# Altium schematic sheet Main.SchDoc
size A3
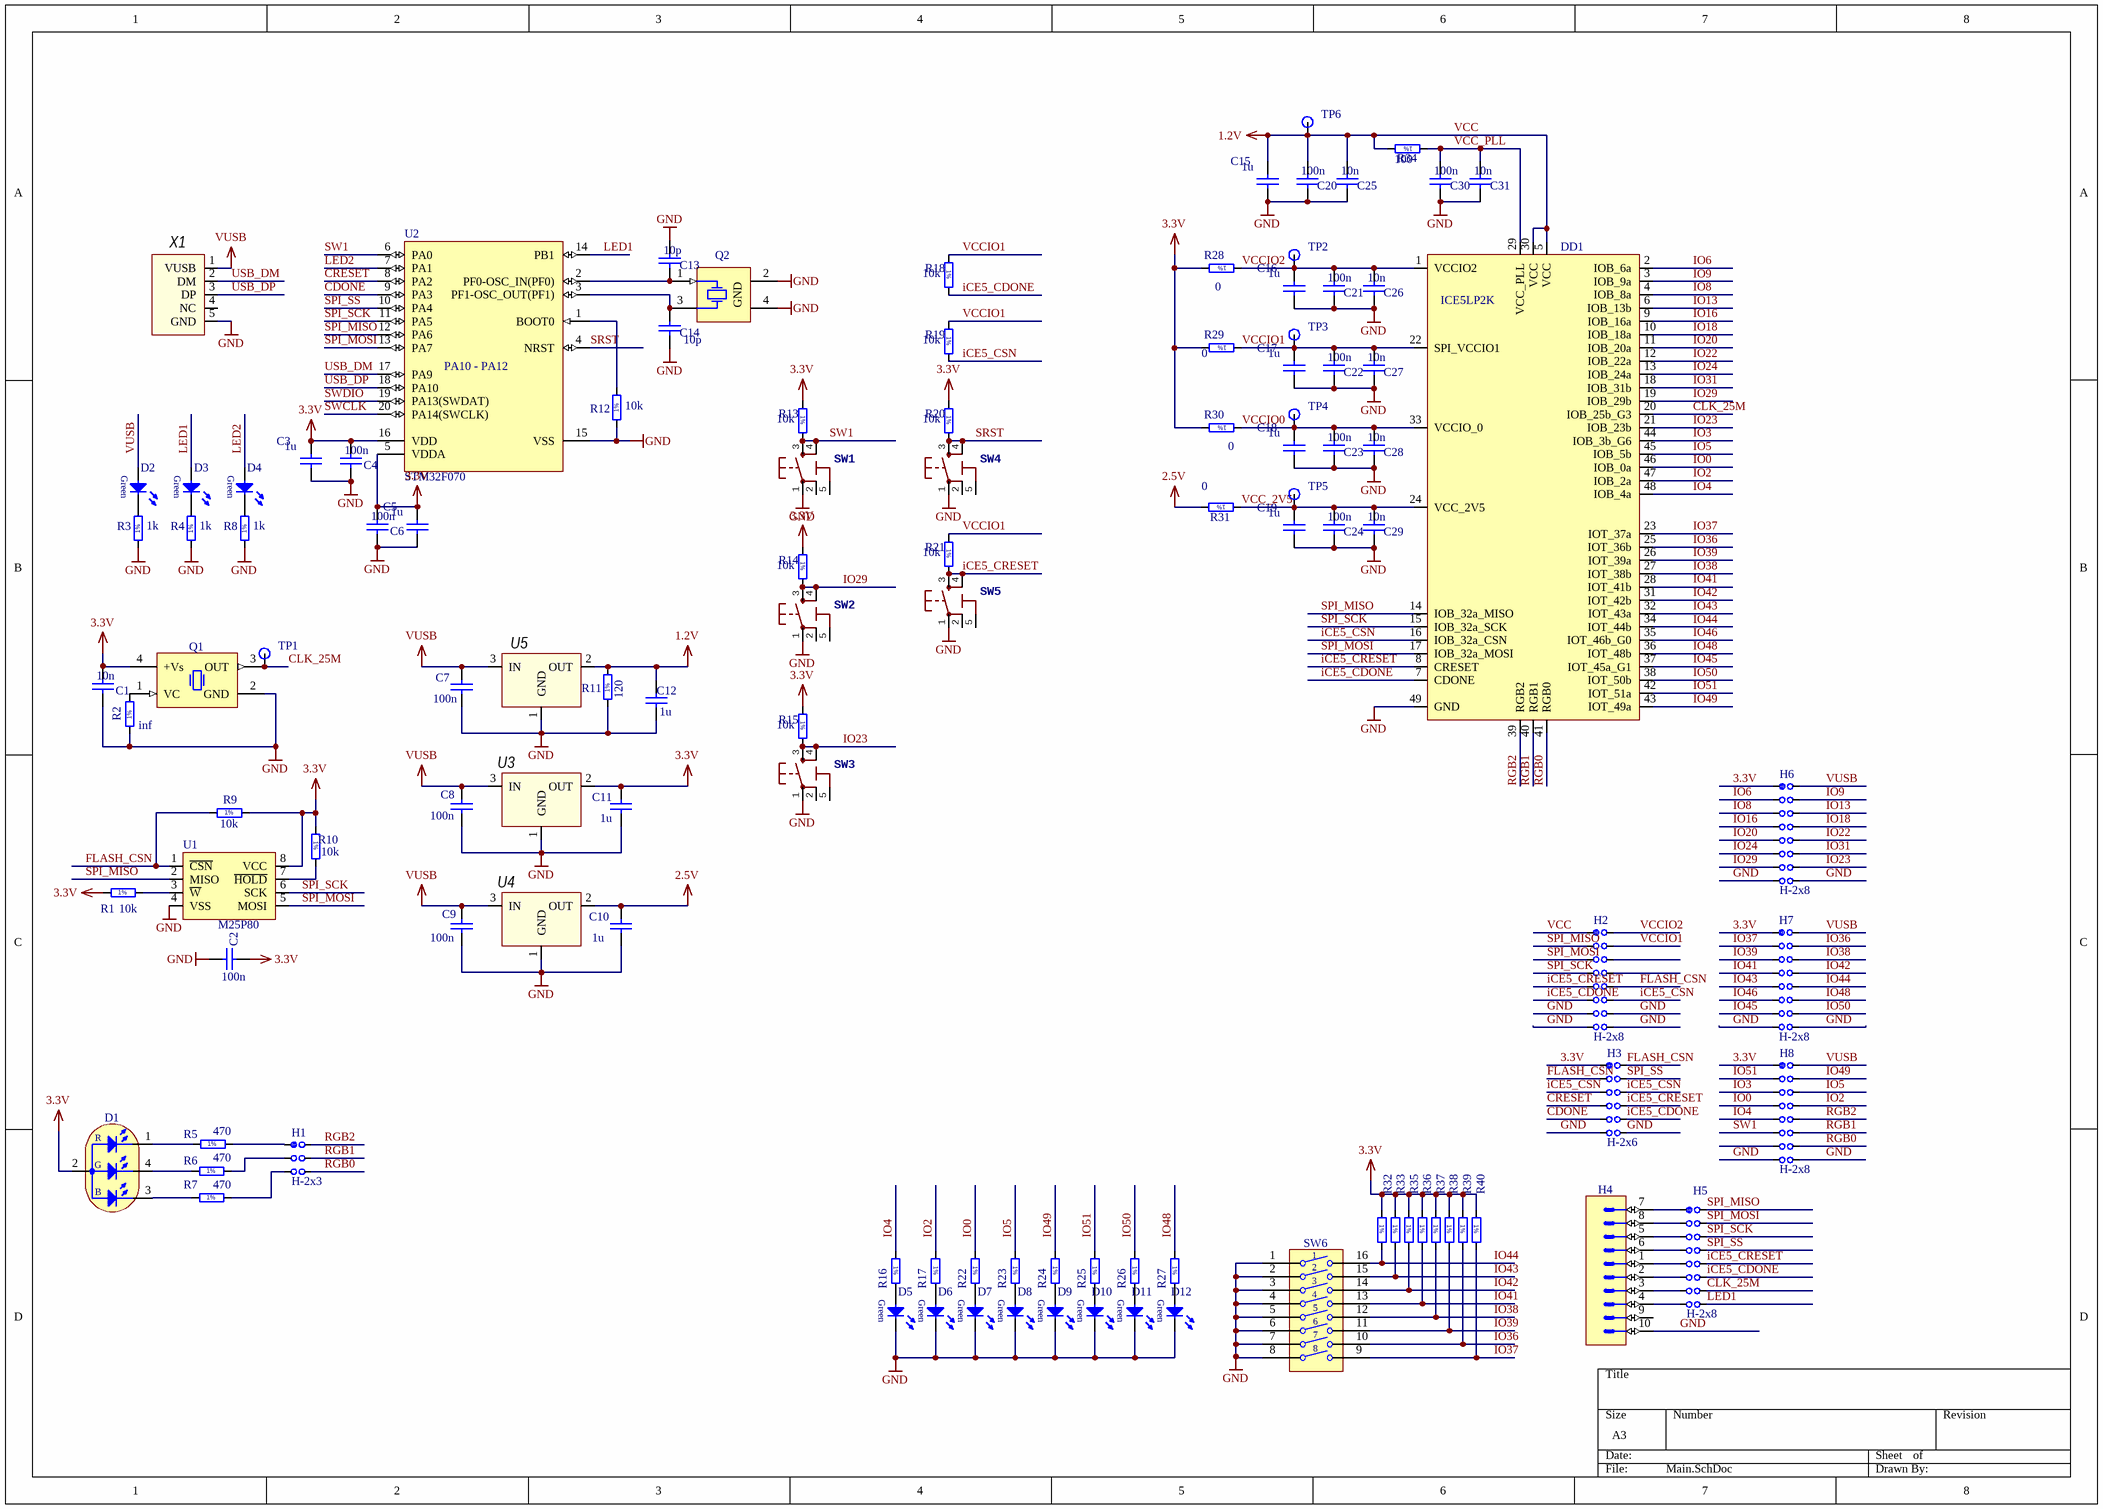
[diagram p0: Main.SchDoc]

## Parts
C1  10n  [CAPC1005X55N]
C2  100n  [CAPC1005X55N]
C3  1u  [CAPC1005X55N]
C4  100n  [CAPC1005X55N]
C5  1u  [CAPC1005X55N]
C6  100n  [CAPC1005X55N]
C7  100n  [CAPC1608X85N]
C8  100n  [CAPC1608X85N]
C9  100n  [CAPC1608X85N]
C10  1u  [CAPC1608X85N]
C11  1u  [CAPC1608X85N]
C12  1u  [CAPC1608X85N]
C13  10p  [CAPC1005X55N]
C14  10p  [CAPC1005X55N]
C15  1u  [CAPC1005X55N]
C16  1u  [CAPC1005X55N]
C17  1u  [CAPC1005X55N]
C18  1u  [CAPC1005X55N]
C19  1u  [CAPC1005X55N]
C20  100n  [CAPC1005X55N]
C21  100n  [CAPC1005X55N]
C22  100n  [CAPC1005X55N]
C23  100n  [CAPC1005X55N]
C24  100n  [CAPC1005X55N]
C25  10n  [CAPC1005X55N]
C26  10n  [CAPC1005X55N]
C27  10n  [CAPC1005X55N]
C28  10n  [CAPC1005X55N]
C29  10n  [CAPC1005X55N]
C30  100n  [CAPC1005X55N]
C31  10n  [CAPC1005X55N]
D1  Red/Green/Blue  [LED_CREE_CLV1A-FKB]  (value not drawn)
D2  Green  [LED_OSRAM_LGL29K]  (value not drawn)
D3  Green  [LED_OSRAM_LGL29K]  (value not drawn)
D4  Green  [LED_OSRAM_LGL29K]  (value not drawn)
D5  Green  [LED_OSRAM_LGL29K]  (value not drawn)
D6  Green  [LED_OSRAM_LGL29K]  (value not drawn)
D7  Green  [LED_OSRAM_LGL29K]  (value not drawn)
D8  Green  [LED_OSRAM_LGL29K]  (value not drawn)
D9  Green  [LED_OSRAM_LGL29K]  (value not drawn)
D10  Green  [LED_OSRAM_LGL29K]  (value not drawn)
D11  Green  [LED_OSRAM_LGL29K]  (value not drawn)
D12  Green  [LED_OSRAM_LGL29K]  (value not drawn)
DD1  ICE5LP2K  [QFN50P700X700X100_HS-49L]
H1  H-2x3  [J2x3]
H2  H-2x8  [J2x8]
H3  H-2x6  [J2x6]
H4  Header 10  [3M_N2510-6002RB]  (value not drawn)
H5  H-2x8  [J2x8]
H6  H-2x8  [J2x8]
H7  H-2x8  [J2x8]
H8  H-2x8  [J2x8]
Q1  25MHz  [OSCCC320X500X160-4N]  (value not drawn)
Q2  114.285MHZ  [XTAL_CONNOR_CS]  (value not drawn)
R1  10k  [RESC1608X55N]
R2  inf  [RESC1608X55N]
R3  1k  [RESC1608X55N]
R4  1k  [RESC1608X55N]
R5  470  [RESC2012X60N]
R6  470  [RESC2012X60N]
R7  470  [RESC2012X60N]
R8  1k  [RESC1608X55N]
R9  10k  [RESC1608X55N]
R10  10k  [RESC1608X55N]
R11  120  [RESC1608X55N]
R12  10k  [RESC1608X55N]
R13  10k  [RESC1608X55N]
R14  10k  [RESC1608X55N]
R15  10k  [RESC1608X55N]
R16  1k  [RESC1608X55N]  (value not drawn)
R17  1k  [RESC1608X55N]  (value not drawn)
R18  10k  [RESC1608X55N]
R19  10k  [RESC1608X55N]
R20  10k  [RESC1608X55N]
R21  10k  [RESC1608X55N]
R22  1k  [RESC1608X55N]  (value not drawn)
R23  1k  [RESC1608X55N]  (value not drawn)
R24  1k  [RESC1608X55N]  (value not drawn)
R25  1k  [RESC1608X55N]  (value not drawn)
R26  1k  [RESC1608X55N]  (value not drawn)
R27  1k  [RESC1608X55N]  (value not drawn)
R28  0  [RESC1608X55N]
R29  0  [RESC1608X55N]
R30  0  [RESC1608X55N]
R31  0  [RESC1608X55N]
R32  10k  [RESC1608X55N]  (value not drawn)
R33  10k  [RESC1608X55N]  (value not drawn)
R34  100  [RESC1608X55N]
R35  10k  [RESC1608X55N]  (value not drawn)
R36  10k  [RESC1608X55N]  (value not drawn)
R37  10k  [RESC1608X55N]  (value not drawn)
R38  10k  [RESC1608X55N]  (value not drawn)
R39  10k  [RESC1608X55N]  (value not drawn)
R40  10k  [RESC1608X55N]  (value not drawn)
SW1  TS42 Dongnan Electronics Tact switch VDC 12V - 50mA  [TS42]  (value not drawn)
SW2  TS42 Dongnan Electronics Tact switch VDC 12V - 50mA  [TS42]  (value not drawn)
SW3  TS42 Dongnan Electronics Tact switch VDC 12V - 50mA  [TS42]  (value not drawn)
SW4  TS42 Dongnan Electronics Tact switch VDC 12V - 50mA  [TS42]  (value not drawn)
SW5  TS42 Dongnan Electronics Tact switch VDC 12V - 50mA  [TS42]  (value not drawn)
SW6  Switch  [SW_TYCO_1825057-7]  (value not drawn)
TP1  TP  [TP no hole]  (value not drawn)
TP2  TP  [TP no hole]  (value not drawn)
TP3  TP  [TP no hole]  (value not drawn)
TP4  TP  [TP no hole]  (value not drawn)
TP5  TP  [TP no hole]  (value not drawn)
TP6  TP  [TP no hole]  (value not drawn)
U1  M25P80  [SOIC127P600X175-8L]
U2  STM32F070  [SOP127P600-8N]
U3  LD1117V33  [SOT230P700X180-4L]  (value not drawn)
U4  LD1117V33  [SOT230P700X180-4L]  (value not drawn)
U5  LD1117V33  [SOT230P700X180-4L]  (value not drawn)
X1  uUSB  [USB-MICROB]  (value not drawn)

## Nets
2.5V: C10.2 R31.2 U4.2(OUT)
3.3V: C1.2 C2.1 C3.2 C4.2 C5.2 C6.2 C11.2 D1.2(AC) H3.1 H6.1 H7.1 H8.1 Q1.4(+Vs) R1.1 R9.2 R10.1 R13.1 R14.1 R15.1 R20.1 R28.2 R29.2 R30.2 R32.1 R33.1 R35.1 R36.1 R37.1 R38.1 R39.1 R40.1 U1.8(VCC) U2.5(VDDA) U2.16(VDD) U3.2(OUT)
GND: C1.1 C2.2 C3.1 C4.1 C5.1 C6.1 C7.1 C8.1 C9.1 C10.1 C11.1 C12.1 C13.2 C14.1 C15.1 C16.1 C17.1 C18.1 C19.1 C20.1 C21.1 C22.1 C23.1 C24.1 C25.1 C26.1 C27.1 C28.1 C29.1 C30.1 C31.1 D5.1(C) D6.1(C) D7.1(C) D8.1(C) D9.1(C) D10.1(C) D11.1(C) D12.1(C) DD1.49(GND) H2.1 H2.2 H2.3 H2.4 H3.7 H3.8 H4.10 H6.15 H6.16 H7.15 H7.16 H8.15 H8.16 Q1.2(GND) Q2.2(GND) Q2.4(GND) R2.1 R3.1 R4.1 R8.1 R11.1 R12.1 SW1.1 SW2.1 SW3.1 SW4.1 SW5.1 SW6.1 SW6.2 SW6.3 SW6.4 SW6.5 SW6.6 SW6.7 SW6.8 U1.4(VSS) U2.15(VSS) U3.1(GND) U4.1(GND) U5.1(GND) X1.5(GND)
VCC: C12.2 C15.2 C20.2 C25.2 DD1.5(VCC) DD1.30(VCC) H2.9 R11.2 R34.2 TP6.1 U5.2(OUT)  [also labelled 1.2V]
VUSB: C7.2 C8.2 C9.2 D2.2(A) H6.2 H7.2 H8.2 U3.3(IN) U4.3(IN) U5.3(IN) X1.1(VUSB)
CDONE: H3.11 U2.9(PA3)
CLK_25M: DD1.20(IOB_25b_G3) H5.14 Q1.3(OUT) TP1.1
CRESET: H3.9 U2.8(PA2)
FLASH_CSN: H2.16 H3.2 H3.3 R9.1 U1.1(~{CSN})
iCE5_CDONE: DD1.7(CDONE) H2.5 H3.12 H5.12 R18.2
iCE5_CRESET: DD1.8(CRESET) H2.7 H3.10 H5.10 R21.2 SW5.3 SW5.4
iCE5_CSN: DD1.16(IOB_32a_CSN) H2.14 H3.5 H3.6 R19.2
IO0: DD1.46(IOB_0a) H8.9 R22.1
IO2: DD1.47(IOB_2a) H8.12 R17.1
IO3: DD1.44(IOB_3b_G6) H8.7
IO4: DD1.48(IOB_4a) H8.11 R16.1
IO5: DD1.45(IOB_5b) H8.10 R23.1
IO6: DD1.2(IOB_6a) H6.3
IO8: DD1.4(IOB_8a) H6.5
IO9: DD1.3(IOB_9a) H6.4
IO13: DD1.6(IOB_13b) H6.6
IO16: DD1.9(IOB_16a) H6.7
IO18: DD1.10(IOB_18a) H6.8
IO20: DD1.11(IOB_20a) H6.9
IO22: DD1.12(IOB_22a) H6.10
IO23: DD1.21(IOB_23b) H6.14 R15.2 SW3.3 SW3.4
IO24: DD1.13(IOB_24a) H6.11
IO29: DD1.19(IOB_29b) H6.13 R14.2 SW2.3 SW2.4
IO31: DD1.18(IOB_31b) H6.12
IO36: DD1.25(IOT_36b) H7.4 R39.2 SW6.10
IO37: DD1.23(IOT_37a) H7.3 R40.2 SW6.9
IO38: DD1.27(IOT_38b) H7.6 R37.2 SW6.12
IO39: DD1.26(IOT_39a) H7.5 R38.2 SW6.11
IO41: DD1.28(IOT_41b) H7.7 R36.2 SW6.13
IO42: DD1.31(IOT_42b) H7.8 R35.2 SW6.14
IO43: DD1.32(IOT_43a) H7.9 R33.2 SW6.15
IO44: DD1.34(IOT_44b) H7.10 R32.2 SW6.16
IO45: DD1.37(IOT_45a_G1) H7.13
IO46: DD1.35(IOT_46b_G0) H7.11
IO48: DD1.36(IOT_48b) H7.12 R27.1
IO49: DD1.43(IOT_49a) H8.8 R24.1
IO50: DD1.38(IOT_50b) H7.14 R26.1
IO51: DD1.42(IOT_51a) H8.5 R25.1
LED1: D3.2(A) H5.16 U2.14(PB1)
LED2: D4.2(A) U2.7(PA1)
RGB0: DD1.41(RGB0) H1.6 H8.6
RGB1: DD1.40(RGB1) H1.4 H8.3
RGB2: DD1.39(RGB2) H1.2 H8.4
SPI_MISO: DD1.14(IOB_32a_MISO) H2.15 H5.2 U1.2(MISO) U2.12(PA6)
SPI_MOSI: DD1.17(IOB_32a_MOSI) H2.13 H5.4 U1.5(MOSI) U2.13(PA7)
SPI_SCK: DD1.15(IOB_32a_SCK) H2.11 H5.6 U1.6(SCK) U2.11(PA5)
SPI_SS: H3.4 H5.8 U2.10(PA4)
SRST: R20.2 SW4.3 SW4.4 U2.4(NRST)
SW1: H8.14 R13.2 SW1.3 SW1.4 U2.6(PA0)
SWCLK: U2.20(PA14(SWCLK))
SWDIO: U2.19(PA13(SWDAT))
USB_DM: U2.17(PA9) X1.2(DM)
USB_DP: U2.18(PA10) X1.3(DP)
VCC_2V5: C19.2 C24.2 C29.2 DD1.24(VCC_2V5) R31.1 TP5.1
VCC_PLL: C30.2 C31.2 DD1.29(VCC_PLL) R34.1
VCCIO0: C18.2 C23.2 C28.2 DD1.33(VCCIO_0) R30.1 TP4.1
VCCIO1: C17.2 C22.2 C27.2 DD1.22(SPI_VCCIO1) H2.10 R18.1 R19.1 R21.1 R29.1 TP3.1
VCCIO2: C16.2 C21.2 C26.2 DD1.1(VCCIO2) H2.6 R28.1 TP2.1
NetC13_1: C13.1 Q2.1(X) U2.2(PF0-OSC_IN(PF0))
NetC14_2: C14.2 Q2.3(X) U2.3(PF1-OSC_OUT(PF1))
NetD1_1: D1.1(CR) R5.1
NetD1_3: D1.3(CB) R7.1
NetD1_4: D1.4(CG) R6.1
NetD2_1: D2.1(C) R3.2
NetD3_1: D3.1(C) R4.2
NetD4_1: D4.1(C) R8.2
NetD5_2: D5.2(A) R16.2
NetD6_2: D6.2(A) R17.2
NetD7_2: D7.2(A) R22.2
NetD8_2: D8.2(A) R23.2
NetD9_2: D9.2(A) R24.2
NetD10_2: D10.2(A) R25.2
NetD11_2: D11.2(A) R26.2
NetD12_2: D12.2(A) R27.2
NetH1_1: H1.1 R5.2
NetH1_3: H1.3 R6.2
NetH1_5: H1.5 R7.2
NetH4_1: H4.1 H5.9
NetH4_2: H4.2 H5.11
NetH4_3: H4.3 H5.13
NetH4_4: H4.4 H5.15
NetH4_5: H4.5 H5.5
NetH4_6: H4.6 H5.7
NetH4_7: H4.7 H5.1
NetH4_8: H4.8 H5.3
NetQ1_1: Q1.1(VC) R2.2
NetR1_2: R1.2 U1.3(~{W})
NetR10_2: R10.2 U1.7(~{HOLD})
NetR12_2: R12.2 U2.1(BOOT0)

Not connected (* = marked no-connect by the designer): H2 8 12; H4 9; H8 13; SW1 2 5(5-GND); SW2 2 5(5-GND); SW3 2 5(5-GND); SW4 2 5(5-GND); SW5 2 5(5-GND); X1 4(NC)

## Notes on the sheet
- (near U2) PA10 - PA12
- (in symbol LED_CREE_CLV1A-FKB-CJ1M1F1BB7R4S3) R; G; B
- (in symbol R0603_2K7_1%_0.1W_100PPM) 1%
- (in symbol R0805_6R8_1%_0.125W_200PPM) 1%

## Library data of the parts
C1-C6 C13-C31 = CC0402_470NF_6.3V_10%_X5R: Non-polarised capacitor; Part Description: SMD Multilayer Chip Ceramic Capacitor; Manufacturer: GENERIC; Manufacturer1 Part Number: GRM155R60J474KE19D; Voltage: 6.3V; Tolerance: ±10%; Table: Capacitors SMD; TC: X5R; Part Number: CC0402_470NF_6.3V_10%_X5R; Component Kind: Standard; Component Type: Standard; Pin Count: 2; Status: Preferred; Manufacturer Part Number: CC0402_470NF_6.3V_10%_X5R; Case: 0402; Mounted: Yes; Socket: No; SMD: Yes; HelpURL: \\cern.ch\dfs\Applications\Altium\Datasheets\CC0402_X5R_MURATA_GRM.pdf; Author: CERN DEM JLC; CreateDate: 22.04.2010; LatestRevisionDate: 22.04.2010; Manufacturer1 Example: MURATA; Manufacturer1 ComponentHeight: 0.55mm
  C1 C25-C29 C31: Value: 10n
  C2 C4 C6 C20-C24 C30: Value: 100n
  C3 C5 C15-C19: Value: 1u
  C13 C14: Value: 10p
C7-C12 = CPPS0603_2.2NF_16V_5%_PANASONIC_ECHU(X): Non-polarised capacitor; Part Description: Stacked Metallized PPS (Polyphenylene Sulfide) Film Chip Capacitor; Manufacturer Part Number: ECHU1C222JX5; Voltage: 16V; Tolerance: ±5%; Table: Capacitors SMD; Part Number: CPPS0603_2.2NF_16V_5%_PANASONIC_ECHU(X); Component Kind: Standard; Component Type: Standard; Pin Count: 2; Status: None; Manufacturer: PANASONIC; Case: 0603; Mounted: Yes; Socket: No; SMD: Yes; ComponentHeight: 0.85mm; HelpURL: \\cern.ch\dfs\Applications\Altium\Datasheets\CPPS0603_PANASONIC_ECHU(X).pdf; Author: CERN DEM JLC; CreateDate: 15.06.2011; LatestRevisionDate: 15.06.2011
  C7-C9: Value: 100n
  C10-C12: Value: 1u
D1 = LED_CREE_CLV1A-FKB-CJ1M1F1BB7R4S3: Tricolor (RGB) PLCC4 Surface Mount LED With Black Top Surface; Part Description: PLCC4 3 in 1 Surface Mount Tricolor (Red/Green/Blue) LED With Black Top Surface; Manufacturer: CREE; Table: LEDs & Displays; Part Number: LED_CREE_CLV1A-FKB-CJ1M1F1BB7R4S3; Component Kind: Standard; Component Type: Standard; Color: Red/Green/Blue; PackageDescription: PLCC4 3 in 1 Surface Mount Red/Green/Blue LED With Black Top Surface, Body 3.2mm X 2.8mm; Manufacturer Part Number: CLV1A-FKB-CJ1M1F1BB7R4S3; Pin Count: 4; Mounted: Yes; Socket: No; SMD: Yes; ComponentHeight: 2.1mm; HelpURL: \\cern.ch\dfs\Applications\Altium\Datasheets\LED_CREE_CLV1A-FKB-CJ1M1F1BB7R4S3.pdf; Author: CERN DEM JLC; CreateDate: 14.01.2013; LatestRevisionDate: 14.01.2013
D2-D12 = LED_OSRAM_LG L29K-G2J1-24-Z: LED Green 1C 2A; Part Description: Surface Mount Green LED (0603 Case); Manufacturer: OSRAM; Table: LEDs & Displays; Part Number: LED_OSRAM_LG L29K-G2J1-24-Z; Component Kind: Standard; Component Type: Standard; Color: Green; PackageDescription: Green Chip LED, 2-Leads, Body 1.7x0.8mm, IPC Medium Density; Manufacturer Part Number: LG L29K-G2J1-24-Z; Pin Count: 2; Case: 0603; Mounted: Yes; Socket: No; SMD: Yes; ComponentHeight: 0.67mm; HelpURL: \\cern.ch\dfs\Applications\Altium\Datasheets\LED_OSRAM_LGL29K.pdf; Author: CERN DEM JLC; CreateDate: 24.04.2012; LatestRevisionDate: 24.04.2012
DD1 = iCE40UL2K-SG48
H4 = 3M_N2510-6002RB: Connector 10 Male; Part Description: 10 Contacts - Straight .100'' x .100'' Low Profile Four-Wall Header, 2500 Series; Manufacturer: 3M; Part Number: 3M_N2510-6002RB; Component Kind: Standard; Component Type: Standard; Pin Count: 10; Family: Header 10; Mounted: Yes; Socket: No; SMD: No; Status: None; Manufacturer Part Number: N2510-6002RB; ComponentHeight: 10.03mm; HelpURL: \\cern.ch\dfs\Applications\Altium\Datasheets\3M_N2510-6002RB.pdf; Author: CERN DEM JLC; CreateDate: 11.02.2009; LatestRevisionDate: 11.08.2009; Table: 3M
Q1 = OSC_25MHZ_MERCURY_VM53S3-25.000-2.5/-30+75: Oscillator 4 pins 1=VC 2=GND 3=OUT 4=+Vs; Part Description: 3V ±2.5ppmVoltage Controlled Temperature Compensated Crystal Oscillator VM53S3 Serie; Manufacturer: MERCURY ELECTRONICS; Table: Crystals & Oscillators; Part Number: OSC_25MHZ_MERCURY_VM53S3-25.000-2.5/-30+75; Component Kind: Standard; Component Type: Standard; PackageDescription: SMD Oscillator, Corner Convave, 4 pins, 5x3.2mm; Value: 25MHz; Manufacturer Part Number: VM53S3-25.000-2.5/-30+75; Pin Count: 4; Mounted: Yes; Socket: No; SMD: Yes; ComponentHeight: 1.6mm; HelpURL: \\cern.ch\dfs\Applications\Altium\Datasheets\OSC_MERCURY_VM53S3.pdf; Author: CERN DEM JLC; CreateDate: 20.01.2010; LatestRevisionDate: 24.01.2011
Q2 = XTAL_114.285MHZ_CONNOR_CS-018: Crystal 4 pins 1=XTAL Control 2=GND3=XTAL 4=GND; Part Description: ±100ppm 18pF -40°C to +85°C  4 Pins, 3.2x2.5X0.8mm, SMD Crystal Unit, CS-018 Serie; Manufacturer: CONNOR WINFIELD; Manufacturer Part Number: CS-018-114.285M; Table: Crystals & Oscillators; Part Number: XTAL_114.285MHZ_CONNOR_CS-018; Component Kind: Standard; Component Type: Standard; PackageDescription: 4 Pins, 2.5x3.2mm, SMD Sealing Crystal, CS Serie; Value: 114.285MHZ; Pin Count: 4; Mounted: Yes; Socket: No; SMD: Yes; ComponentHeight: 0.8mm; HelpURL: \\cern.ch\dfs\Applications\Altium\Datasheets\XTAL_CONNOR_CS-018.pdf; Author: CERN DEM JLC; CreateDate: 16.04.2013; LatestRevisionDate: 08.07.2014
R1-R4 R8-R40 = R0603_2K7_1%_0.1W_100PPM: Resistor - 1%; Part Description: General Purpose Thick Film Chip Resistor; Manufacturer: GENERIC; Manufacturer1 Part Number: RC0603FR-072K7L; Power: 0.1W; TC: ±100ppm/°C; Table: Resistors SMD; Part Number: R0603_2K7_1%_0.1W_100PPM; Component Kind: Standard; Component Type: Standard; Pin Count: 2; Status: Preferred; Tolerance: ±1%; Manufacturer Part Number: R0603_2K7_1%_0.1W_100PPM; Case: 0603; Mounted: Yes; Socket: No; SMD: Yes; Manufacturer1 Example: YAGEO PHYCOMP; Manufacturer1 ComponentHeight: 0.55mm; HelpURL: \\cern.ch\dfs\Applications\Altium\Datasheets\R0603_PHYCOMP_RC0603.pdf; Author: CERN DEM JLC; CreateDate: 02.05.2011; LatestRevisionDate: 02.05.2011
  R1 R9 R10 R12-R15 R18-R21 R32 R33 R35-R40: Value: 10k
  R2: Value: inf
  R3 R4 R8 R16 R17 R22-R27: Value: 1k
  R11: Value: 120
  R28-R31: Value: 0
  R34: Value: 100
R5-R7 = R0805_6R8_1%_0.125W_200PPM: Resistor - 1%; Part Description: General Purpose Thick Film Chip Resistor; Manufacturer: GENERIC; Manufacturer1 Part Number: 232273466808L or RC0805FR-076R8L; Power: 0.125W; TC: ±200ppm/°C; Table: Resistors SMD; Part Number: R0805_6R8_1%_0.125W_200PPM; Component Kind: Standard; Component Type: Standard; Pin Count: 2; Value: 470; Status: Preferred; Tolerance: ±1%; Manufacturer Part Number: R0805_6R8_1%_0.125W_200PPM; Case: 0805; Mounted: Yes; Socket: No; SMD: Yes; Manufacturer1 Example: YAGEO PHYCOMP; Manufacturer1 ComponentHeight: 0.65mm; HelpURL: \\cern.ch\dfs\Applications\Altium\Datasheets\R0805_Phycomp_RC0805.pdf; Author: CERN DEM JLC; CreateDate: 03.12.2007; LatestRevisionDate: 17.10.2012
SW1-SW5 = TS42
SW6 = SW_TYCO_1825057-7: 8 Ways SPST DIP Switch; Part Description: 8 Ways SPST DIP Switch, Contact Rating 100mA 24VDC; Manufacturer: TYCO ELECTRONICS; Manufacturer Part Number: 1825057-7 or ADE0804; Table: Switches; Part Number: SW_TYCO_1825057-7; Component Kind: Standard; Component Type: Standard; Pin Count: 16; PackageDescription: Body 22.3x7.5mm, 8 Ways SPST DIP Switch, Thru Hole, TYCO AD Series; Family: Switch; Mounted: Yes; Socket: No; SMD: No; Status: None; ComponentHeight: 4.5mm; HelpURL: \\cern.ch\dfs\Applications\Altium\Datasheets\SW_TYCO_1825057-7.pdf; Author: CERN DEM JMW; CreateDate: 19.09.2008; LatestRevisionDate: 19.09.2008
U2 = STM32F070F4P6: ARM Cortex-M0 32-bit MCU, 32 KB Flash, 4 KB Internal RAM, 15 I/Os, 20-pin TSSOP, -40 to 85 degC, Tube; PartNumber: STM32F050F6P6; FLASH Size (Prog) (kB): 32; I/Os (High Current): 15; Internal RAM Size (kB): 4; Operating Frequency(F) (Processor speed) (MHz): 48; Supply Voltage(Vcc) min (V): 2; DatasheetVersion: Rev. 1; PackageVersion: Rev. 1, 11/2012; PackageReference: TSSOP20; PackageDescription: 20-Pin Thin Shrink Small Outline Package, 6.5 x 4.4 mm Body, 0.65 mm Pitch; Supplier 1: Digi-Key; Supplier Part Number 1: STM32F050F6P6-ND; Supplier 2: Farnell; Supplier Part Number 2: 2333136; Supplier 3: Newark; Supplier Part Number 3: 99W9749; Supplier 4: Newark; Supplier Part Number 4: 89W1489; Supplier 5: Mouser; Supplier Part Number 5: 511-STM32F050F6P6; Core: ARM Cortex-M0; Packing: Tube; Mounting Technology: Surface Mount; ComponentLink1Description: Manufacturer URL; ComponentLink1URL: http://www.st.com/web/en/home.html; ComponentLink2Description: Datasheet; ComponentLink2URL: http://www.st.com/st-web-ui/static/active/en/resource/technical/document/datasheet/DM00065136.pdf; ComponentLink3Description: Package Specification; ComponentLink3URL: http://www.st.com/st-web-ui/static/active/en/resource/technical/document/datasheet/DM00065136.pdf; Supplier 6: Farnell; Supplier Part Number 6: 2488284
U3-U5 = LD1117V33: LD1117V33 3.3V Voltage regulator
X1 = usb: micro USB
H1 = H-2x3: Price: 0.06
H2 H5-H8 = H-2x8: Price: 0.16
H3 = H-2x6: Price: 0.12